# EAGLE schematic power_supply_module (EAGLE 8.1.0)
AUTHOR: N. Jackson; REV: A; TITLE: Power Supply Module

## Sheet 1 of 8: Header and Mouting holes for Power Module
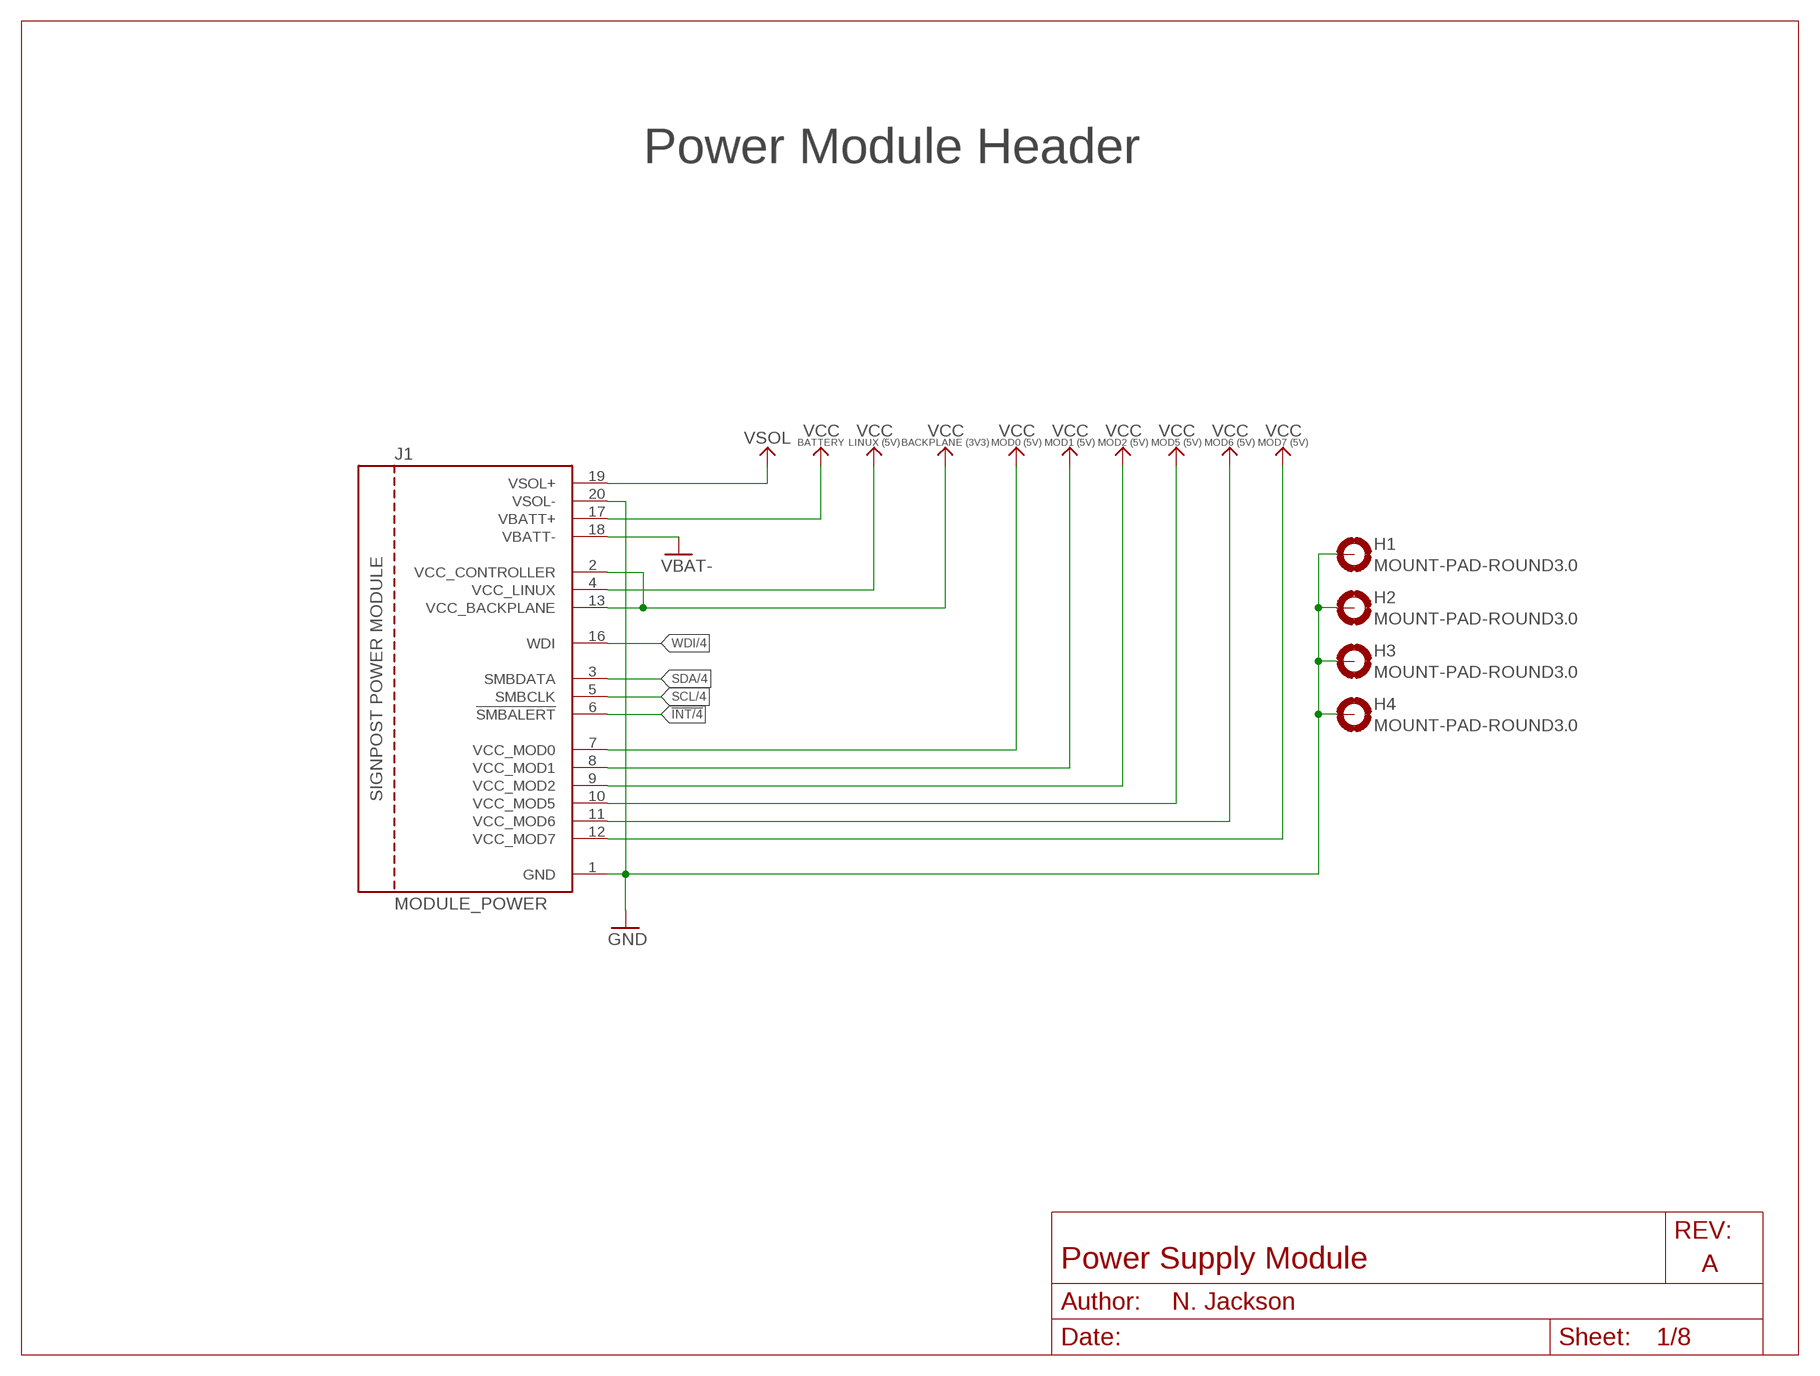
[diagram p0: schematic, sheet 1]

### Parts
H1  MOUNT-PAD-ROUND3.0  [3,0-PAD]
H2  MOUNT-PAD-ROUND3.0  [3,0-PAD]
H3  MOUNT-PAD-ROUND3.0  [3,0-PAD]
H4  MOUNT-PAD-ROUND3.0  [3,0-PAD]
J1  MODULE_POWER  [MODULE_POWER]

### Nets
!INT: J1.6(!SMBALERT) ; also sheet 4,6,7
GND: H1.B3,0(MOUNT) H2.B3,0(MOUNT) H3.B3,0(MOUNT) H4.B3,0(MOUNT) J1.1(GND) J1.20(VSOL-) ; also sheet 2,3,4,5,6,7,8
SCL: J1.5(SMBCLK) ; also sheet 4,5,6,7,8
SDA: J1.3(SMBDATA) ; also sheet 4,5,6,7,8
VBAT+: J1.17(VBATT+) ; supply symbol labelled VCC_BATT+ ; also sheet 2,3,4,8
VBAT-: J1.18(VBATT-) ; also sheet 4,8
VCC_BACKPLANE: J1.2(VCC_CONTROLLER) J1.13(VCC_BACKPLANE) ; also sheet 4,5,6,7,8
VCC_LINUX: J1.4(VCC_LINUX) ; also sheet 6
VCC_MOD0: J1.7(VCC_MOD0) ; also sheet 6
VCC_MOD1: J1.8(VCC_MOD1) ; also sheet 6
VCC_MOD2: J1.9(VCC_MOD2) ; also sheet 7
VCC_MOD5: J1.10(VCC_MOD5) ; also sheet 7
VCC_MOD6: J1.11(VCC_MOD6) ; also sheet 7
VCC_MOD7: J1.12(VCC_MOD7) ; also sheet 7
VSOL+: J1.19(VSOL+) ; supply symbol labelled VCC_SOL ; also sheet 4,8
WDI: J1.16(WDI) ; also sheet 4

### Notes on the sheet
- Power Module Header

## Sheet 2 of 8: Regulators for 3v3 and 5v power rails
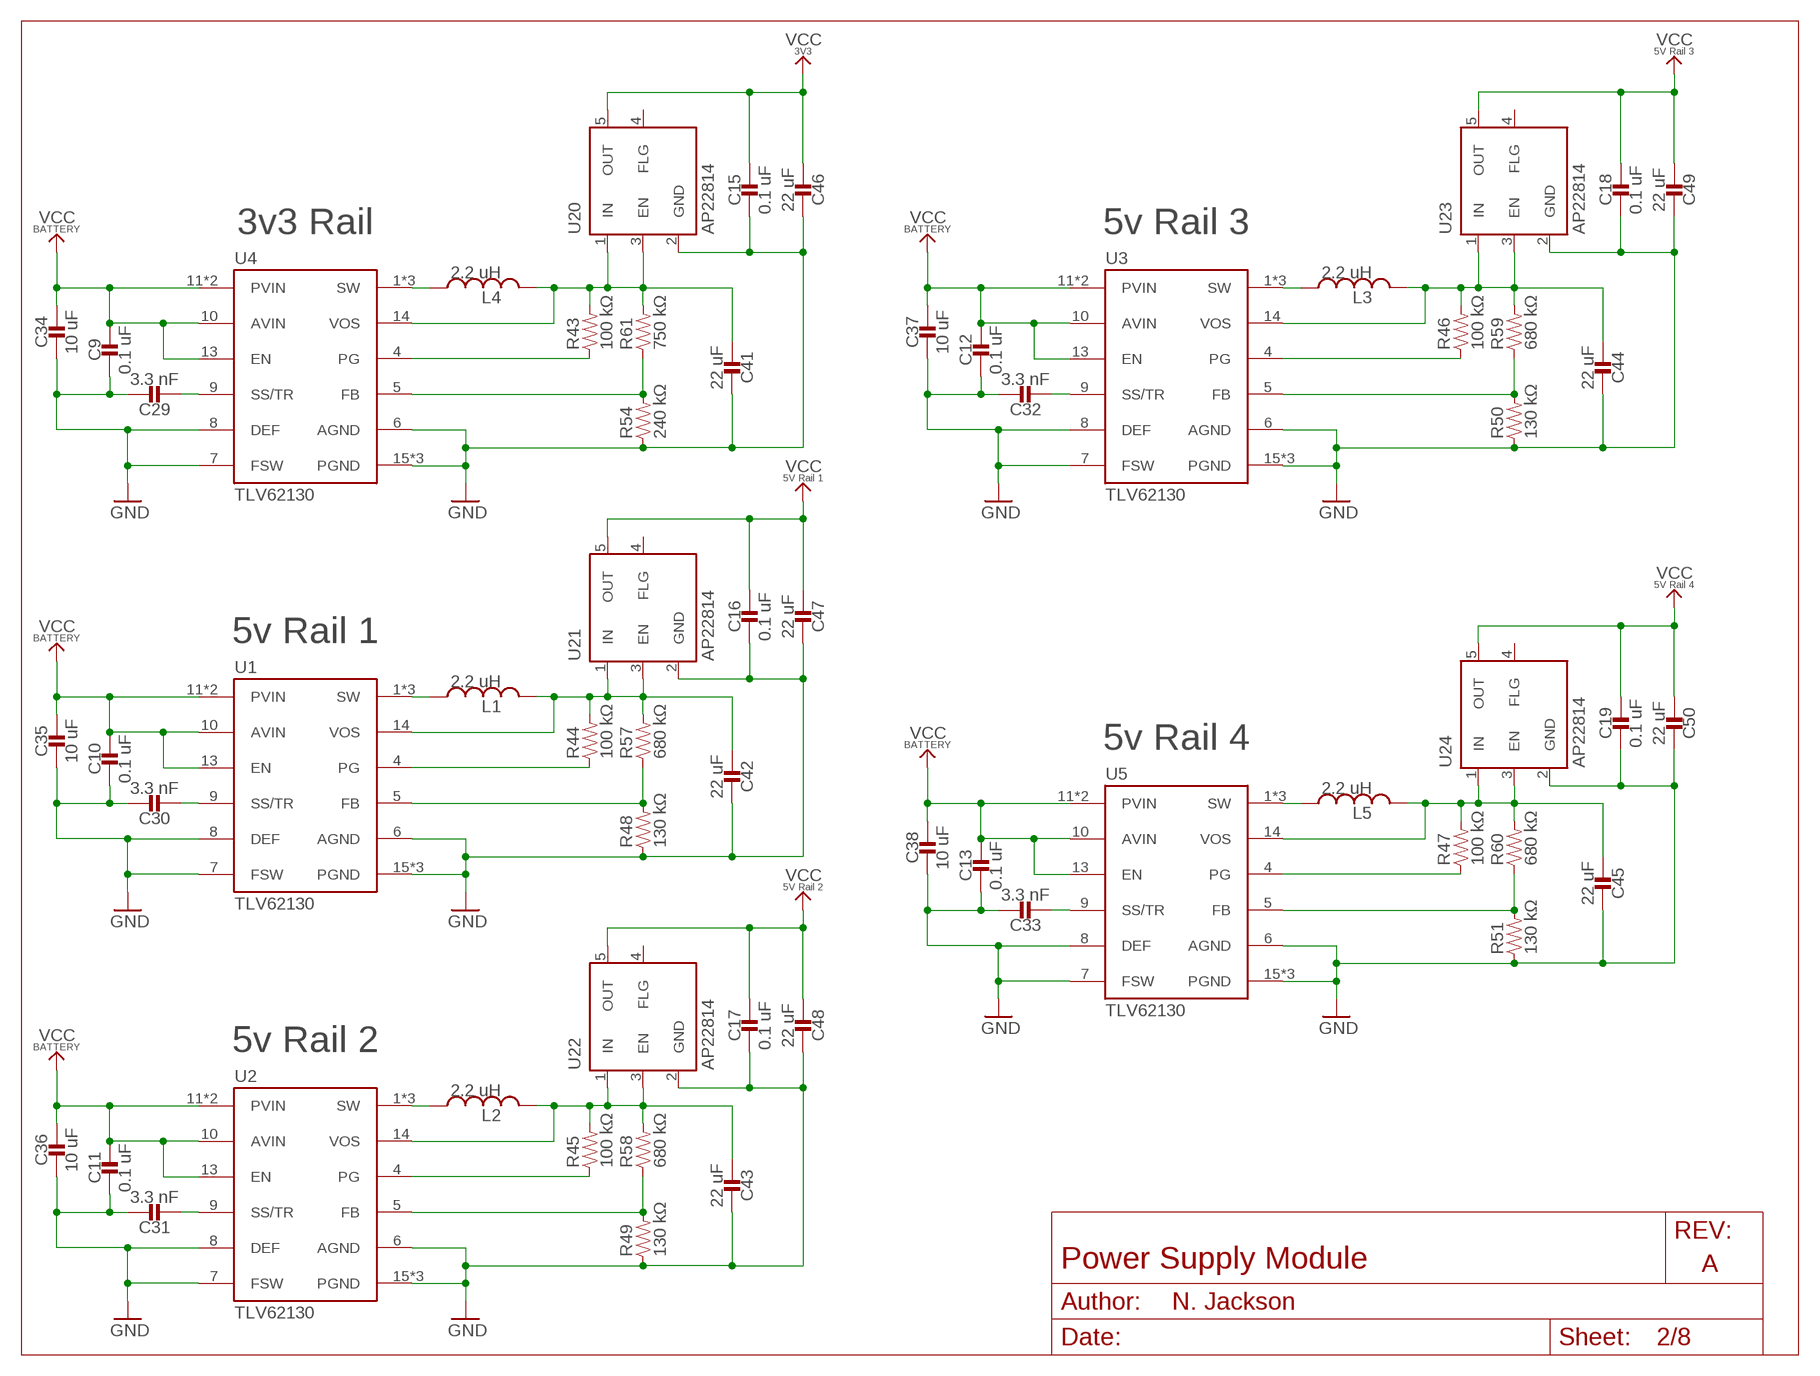
[diagram p1: schematic, sheet 2]

### Parts
C9  0.1 uF  CAPACITOR0402_CAP  [0402_CAP]
C10  0.1 uF  CAPACITOR0402_CAP  [0402_CAP]
C11  0.1 uF  CAPACITOR0402_CAP  [0402_CAP]
C12  0.1 uF  CAPACITOR0402_CAP  [0402_CAP]
C13  0.1 uF  CAPACITOR0402_CAP  [0402_CAP]
C15  0.1 uF  CAPACITOR0402_CAP  [0402_CAP]
C16  0.1 uF  CAPACITOR0402_CAP  [0402_CAP]
C17  0.1 uF  CAPACITOR0402_CAP  [0402_CAP]
C18  0.1 uF  CAPACITOR0402_CAP  [0402_CAP]
C19  0.1 uF  CAPACITOR0402_CAP  [0402_CAP]
C29  3.3 nF  CAPACITOR0402_CAP  [0402_CAP]
C30  3.3 nF  CAPACITOR0402_CAP  [0402_CAP]
C31  3.3 nF  CAPACITOR0402_CAP  [0402_CAP]
C32  3.3 nF  CAPACITOR0402_CAP  [0402_CAP]
C33  3.3 nF  CAPACITOR0402_CAP  [0402_CAP]
C34  10 uF  CAPACITOR0805_CAP  [0805_CAP]
C35  10 uF  CAPACITOR0805_CAP  [0805_CAP]
C36  10 uF  CAPACITOR0805_CAP  [0805_CAP]
C37  10 uF  CAPACITOR0805_CAP  [0805_CAP]
C38  10 uF  CAPACITOR0805_CAP  [0805_CAP]
C41  22 uF  CAPACITOR0603_CAP  [0603_CAP]
C42  22 uF  CAPACITOR0603_CAP  [0603_CAP]
C43  22 uF  CAPACITOR0603_CAP  [0603_CAP]
C44  22 uF  CAPACITOR0603_CAP  [0603_CAP]
C45  22 uF  CAPACITOR0603_CAP  [0603_CAP]
C46  22 uF  CAPACITOR0603_CAP  [0603_CAP]
C47  22 uF  CAPACITOR0603_CAP  [0603_CAP]
C48  22 uF  CAPACITOR0603_CAP  [0603_CAP]
C49  22 uF  CAPACITOR0603_CAP  [0603_CAP]
C50  22 uF  CAPACITOR0603_CAP  [0603_CAP]
L1  2.2 uH  INDUCTORIHL  [IHL-1212BZ-11]
L2  2.2 uH  INDUCTORIHL  [IHL-1212BZ-11]
L3  2.2 uH  INDUCTORIHL  [IHL-1212BZ-11]
L4  2.2 uH  INDUCTORIHL  [IHL-1212BZ-11]
L5  2.2 uH  INDUCTORIHL  [IHL-1212BZ-11]
R43  100 kΩ  RESISTOR0402_RES  [0402_RES]
R44  100 kΩ  RESISTOR0402_RES  [0402_RES]
R45  100 kΩ  RESISTOR0402_RES  [0402_RES]
R46  100 kΩ  RESISTOR0402_RES  [0402_RES]
R47  100 kΩ  RESISTOR0402_RES  [0402_RES]
R48  130 kΩ  RESISTOR0402_RES  [0402_RES]
R49  130 kΩ  RESISTOR0402_RES  [0402_RES]
R50  130 kΩ  RESISTOR0402_RES  [0402_RES]
R51  130 kΩ  RESISTOR0402_RES  [0402_RES]
R54  240 kΩ  RESISTOR0402_RES  [0402_RES]
R57  680 kΩ  RESISTOR0402_RES  [0402_RES]
R58  680 kΩ  RESISTOR0402_RES  [0402_RES]
R59  680 kΩ  RESISTOR0402_RES  [0402_RES]
R60  680 kΩ  RESISTOR0402_RES  [0402_RES]
R61  750 kΩ  RESISTOR0402_RES  [0402_RES]
U1  TLV62130  [TQFN-16/3MM]
U2  TLV62130  [TQFN-16/3MM]
U3  TLV62130  [TQFN-16/3MM]
U4  TLV62130  [TQFN-16/3MM]
U5  TLV62130  [TQFN-16/3MM]
U20  AP22814  [U-DFN2020-6]
U21  AP22814  [U-DFN2020-6]
U22  AP22814  [U-DFN2020-6]
U23  AP22814  [U-DFN2020-6]
U24  AP22814  [U-DFN2020-6]

### Nets
3V3ROUT: C41.2 L4.P$2 R43.2 R61.2 U4.14(VOS) U20.1(IN) U20.3(EN)
5V_1ROUT: C42.2 L1.P$2 R44.2 R57.2 U1.14(VOS) U21.1(IN) U21.3(EN)
5V_2ROUT: C43.2 L2.P$2 R45.2 R58.2 U2.14(VOS) U22.1(IN) U22.3(EN)
5V_3ROUT: C44.2 L3.P$2 R46.2 R59.2 U3.14(VOS) U23.1(IN) U23.3(EN)
5V_4ROUT: C45.2 L5.P$2 R47.2 R60.2 U5.14(VOS) U24.1(IN) U24.3(EN)
GND: C9.2 C10.2 C11.2 C12.2 C13.2 C15.2 C16.2 C17.2 C18.2 C19.2 C29.1 C30.1 C31.1 C32.1 C33.1 C34.P$2 C35.P$2 C36.P$2 C37.P$2 C38.P$2 C41.1 C42.1 C43.1 C44.1 C45.1 C46.1 C47.1 C48.1 C49.1 C50.1 R48.1 R49.1 R50.1 R51.1 R54.1 U1.6(AGND) U1.7(FSW) U1.8(DEF) U1.15(PGND) U1.16(PGND) U1.GND U2.6(AGND) U2.7(FSW) U2.8(DEF) U2.15(PGND) U2.16(PGND) U2.GND U3.6(AGND) U3.7(FSW) U3.8(DEF) U3.15(PGND) U3.16(PGND) U3.GND U4.6(AGND) U4.7(FSW) U4.8(DEF) U4.15(PGND) U4.16(PGND) U4.GND U5.6(AGND) U5.7(FSW) U5.8(DEF) U5.15(PGND) U5.16(PGND) U5.GND U20.2(GND) U21.2(GND) U22.2(GND) U23.2(GND) U24.2(GND) ; also sheet 1,3,4,5,6,7,8
N$1: L4.P$1 U4.1(SW) U4.2(SW) U4.3(SW)
N$3: C30.2 U1.9(SS/TR)
N$5: R44.1 U1.4(PG)
N$6: R48.2 R57.1 U1.5(FB)
N$8: C31.2 U2.9(SS/TR)
N$9: L2.P$1 U2.1(SW) U2.2(SW) U2.3(SW)
N$10: R45.1 U2.4(PG)
N$11: R49.2 R58.1 U2.5(FB)
N$15: C29.2 U4.9(SS/TR)
N$16: L1.P$1 U1.1(SW) U1.2(SW) U1.3(SW)
N$17: C32.2 U3.9(SS/TR)
N$18: R43.1 U4.4(PG)
N$19: R54.2 R61.1 U4.5(FB)
N$29: L3.P$1 U3.1(SW) U3.2(SW) U3.3(SW)
N$30: R46.1 U3.4(PG)
N$31: R50.2 R59.1 U3.5(FB)
N$34: C33.2 U5.9(SS/TR)
N$35: L5.P$1 U5.1(SW) U5.2(SW) U5.3(SW)
N$36: R47.1 U5.4(PG)
N$37: R51.2 R60.1 U5.5(FB)
VBAT+: C9.1 C10.1 C11.1 C12.1 C13.1 C34.P$1 C35.P$1 C36.P$1 C37.P$1 C38.P$1 U1.10(AVIN) U1.11(PVIN) U1.12(PVIN) U1.13(EN) U2.10(AVIN) U2.11(PVIN) U2.12(PVIN) U2.13(EN) U3.10(AVIN) U3.11(PVIN) U3.12(PVIN) U3.13(EN) U4.10(AVIN) U4.11(PVIN) U4.12(PVIN) U4.13(EN) U5.10(AVIN) U5.11(PVIN) U5.12(PVIN) U5.13(EN) ; supply symbol labelled VCC_BATT+ ; also sheet 1,3,4,8
VCC_3V3: C15.1 C46.2 U20.5(OUT) ; also sheet 6,8
VCC_5V_1: C16.1 C47.2 U21.5(OUT) ; also sheet 6,8
VCC_5V_2: C17.1 C48.2 U22.5(OUT) ; also sheet 6,8
VCC_5V_3: C18.1 C49.2 U23.5(OUT) ; also sheet 7,8
VCC_5V_4: C19.1 C50.2 U24.5(OUT) ; also sheet 7,8
Unconnected: U20.4(FLG) U21.4(FLG) U22.4(FLG) U23.4(FLG) U24.4(FLG)

### Notes on the sheet
- 3v3 Rail | 5v Rail 3
- 5v Rail 1
- 5v Rail 4
- 5v Rail 2

## Sheet 3 of 8: Solar Charger
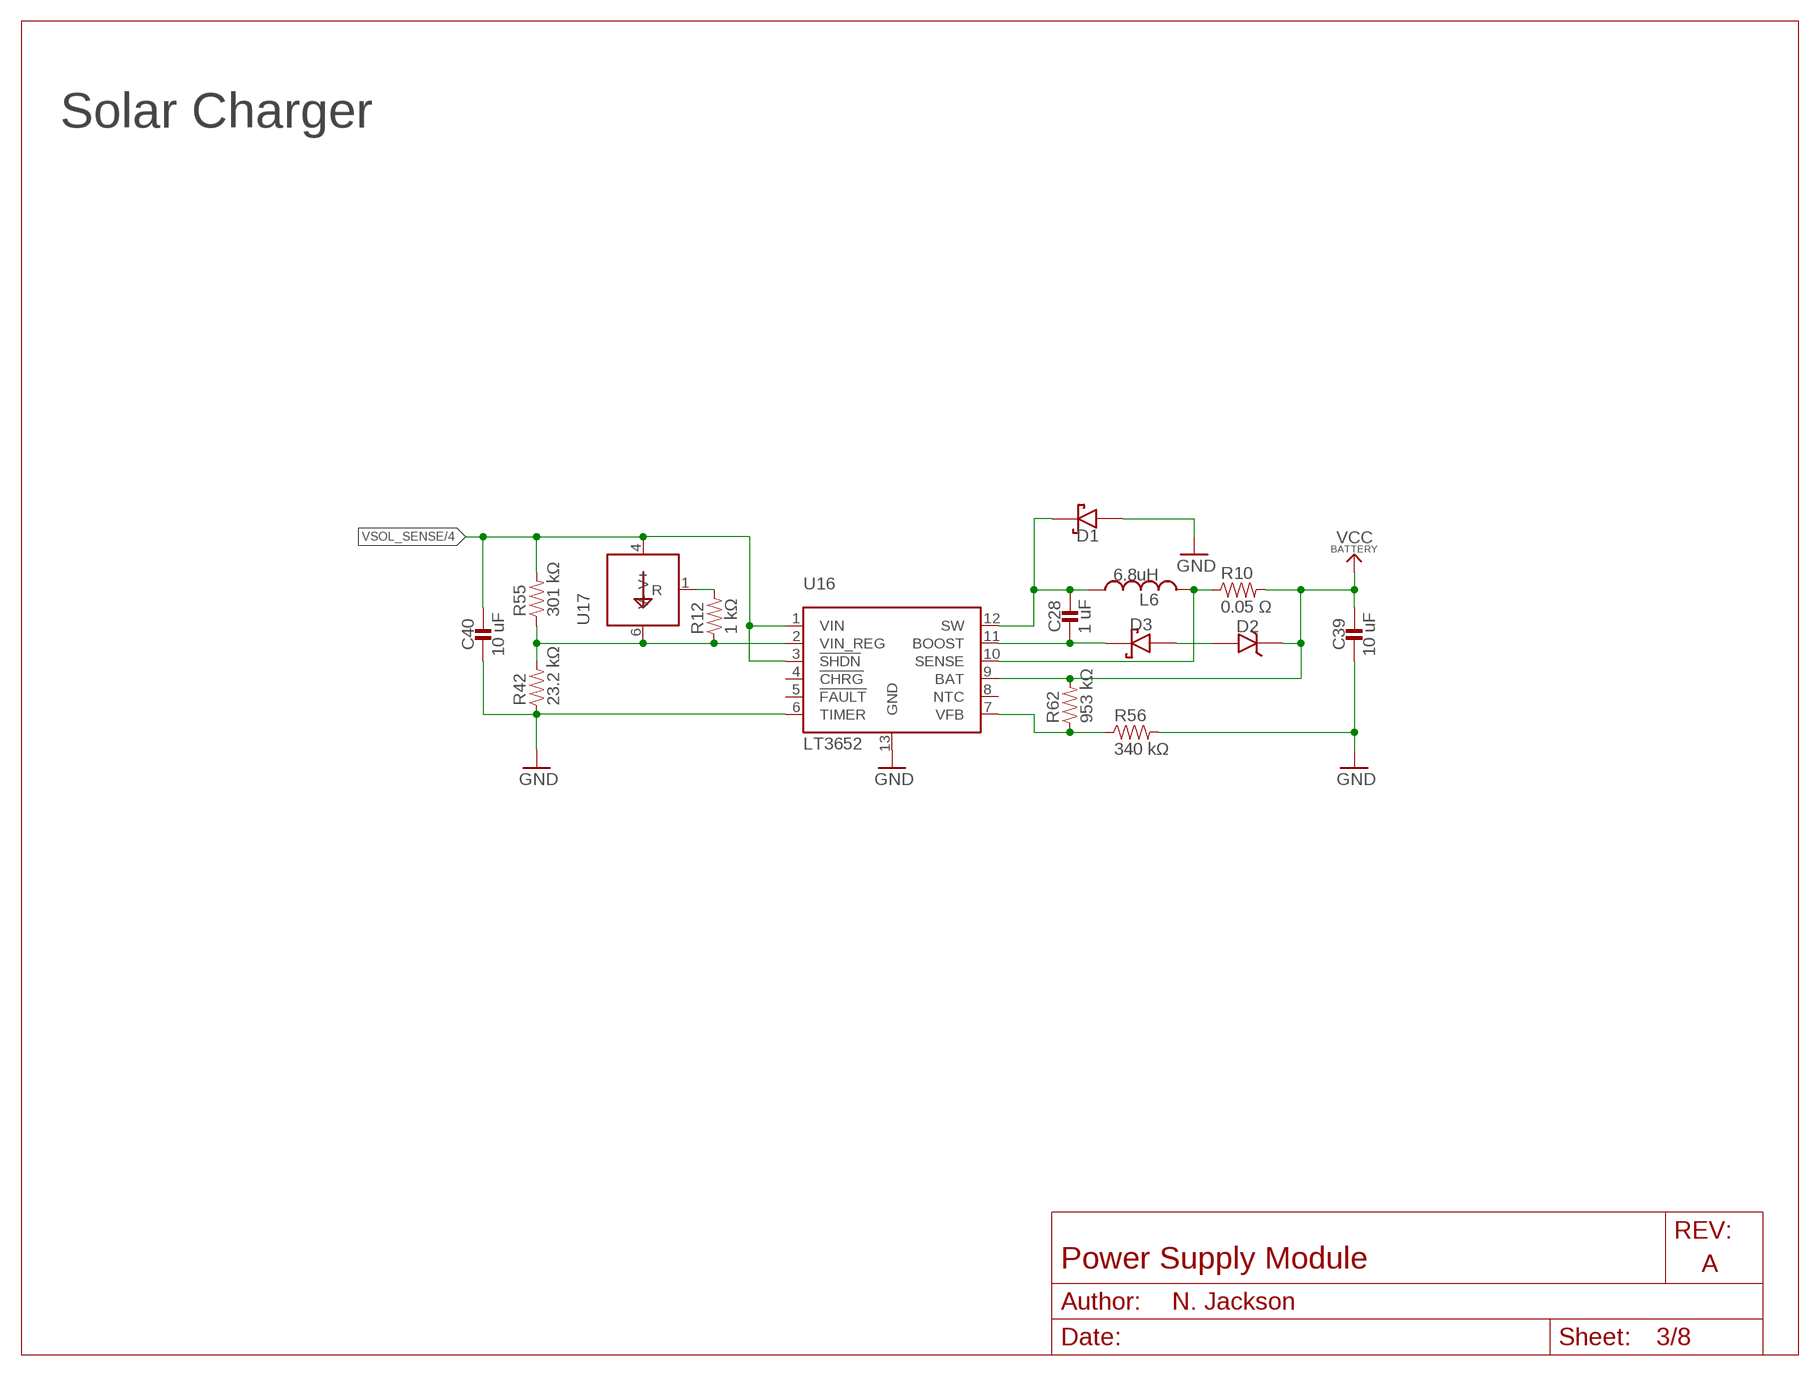
[diagram p2: schematic, sheet 3]

### Parts
C28  1 uF  CAPACITOR0603_CAP  [0603_CAP]
C39  10 uF  CAPACITOR0805_CAP  [0805_CAP]
C40  10 uF  CAPACITOR0805_CAP  [0805_CAP]
D1  DIODE_SCHOTTKYSOT-23F  [SOT-23F]
D2  DIODE_ZENERSOT323  [SOD323]
D3  DIODE_SCHOTTKYSOT-23F  [SOT-23F]
L6  6.8uH  INDUCTORIHL2525CZ  [IHL-2525CZ]
R10  0.05 Ω  RESISTOR0805_RES  [0805_RES]
R12  1 kΩ  RESISTOR0402_RES  [0402_RES]
R42  23.2 kΩ  RESISTOR0402_RES  [0402_RES]
R55  301 kΩ  RESISTOR0402_RES  [0402_RES]
R56  340 kΩ  RESISTOR0402_RES  [0402_RES]
R62  953 kΩ  RESISTOR0402_RES  [0402_RES]
U16  LT3652  [DFN-12/3MM]
U17  LM234  [SOIC-8]

### Nets
BOOST: C28.2 D3.P$3(CATHODE) U16.11(BOOST)
GND: C39.P$2 C40.P$2 D1.P$1(ANODE) R42.1 R56.2 U16.6(TIMER) U16.13(GND) ; also sheet 1,2,4,5,6,7,8
N$44: D2.P$2(ANODE) D3.P$1(ANODE)
N$59: R12.2 U17.1(R)
SENSE: L6.P$2 R10.1 U16.10(SENSE)
SW: C28.1 D1.P$3(CATHODE) L6.P$1 U16.12(SW)
VBAT+: C39.P$1 D2.P$1(CATHODE) R10.2 R62.2 U16.9(BAT) ; supply symbol labelled VCC_BATT+ ; also sheet 1,2,4,8
VFB: R56.1 R62.1 U16.7(VFB)
VINREG: R12.1 R42.2 R55.1 U16.2(VIN_REG) U17.6(V-)
VSOL_SENSE: C40.P$1 R55.2 U16.1(VIN) U16.3(!SHDN) U17.4(V+) ; also sheet 4
Unconnected: U16.4(!CHRG) U16.5(!FAULT) U16.8(NTC)

### Notes on the sheet
- Solar Charger

## Sheet 4 of 8: Battery and Solar Monitors + Watchdog
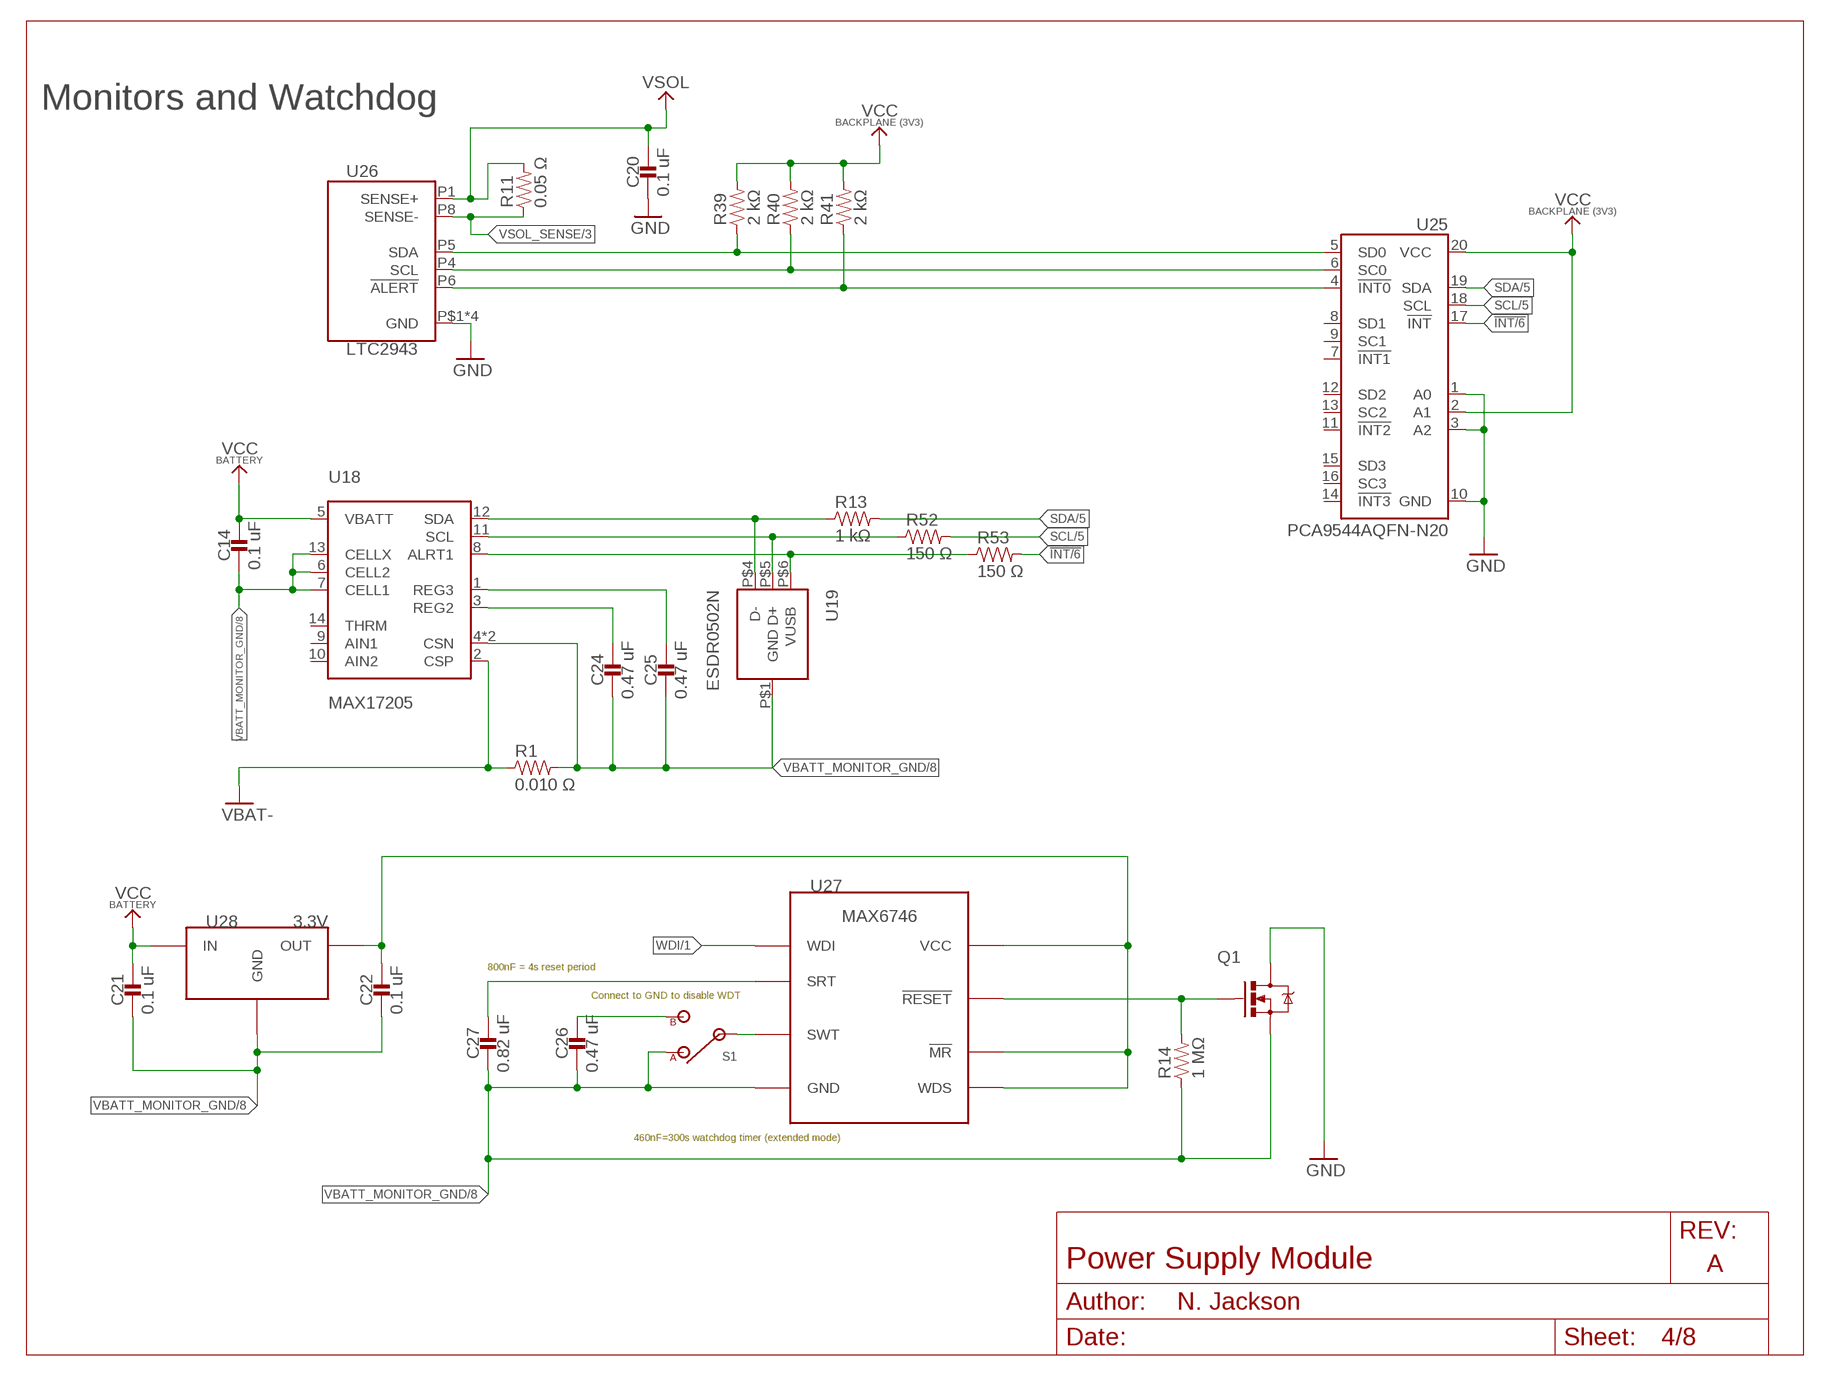
[diagram p3: schematic, sheet 4]

### Parts
C14  0.1 uF  CAPACITOR0402_CAP  [0402_CAP]
C20  0.1 uF  CAPACITOR0402_CAP  [0402_CAP]
C21  0.1 uF  CAPACITOR0402_CAP  [0402_CAP]
C22  0.1 uF  CAPACITOR0402_CAP  [0402_CAP]
C24  0.47 uF  CAPACITOR0402_CAP  [0402_CAP]
C25  0.47 uF  CAPACITOR0402_CAP  [0402_CAP]
C26  0.47 uF  CAPACITOR0402_CAP  [0402_CAP]
C27  0.82 uF  CAPACITOR0402_CAP  [0402_CAP]
Q1  MOSFET-NCHANNELFDD8580  [DPAK]
R1  0.010 Ω  RESISTOR0805_RES  [0805_RES]
R11  0.05 Ω  RESISTOR0805_RES  [0805_RES]
R13  1 kΩ  RESISTOR0402_RES  [0402_RES]
R14  1 MΩ  RESISTOR0402_RES  [0402_RES]
R39  2 kΩ  RESISTOR0402_RES  [0402_RES]
R40  2 kΩ  RESISTOR0402_RES  [0402_RES]
R41  2 kΩ  RESISTOR0402_RES  [0402_RES]
R52  150 Ω  RESISTOR0402_RES  [0402_RES]
R53  150 Ω  RESISTOR0402_RES  [0402_RES]
S1  TE_SSA12/SPDT  [TE_SSA12/SPDT]
U18  MAX17205  [14-TDFN]
U19  ESDR0502N  [UDFN-6]
U25  PCA9544AQFN-N20  [QFN-N20]
U26  LTC2943  [DFN-8]
U27  MAX6746  [SOT-23-8]
U28  3.3V  TILM34803.3V  [SOT-23]

### Nets
!INT: R53.2 U25.17(!INT) ; also sheet 1,6,7
GND: C20.2 Q1.4(D) U25.1(A0) U25.3(A2) U25.10(GND) U26.P2(GND) U26.P3(GND) U26.P7(GND) U26.P$1(GND) ; also sheet 1,2,3,5,6,7,8
N$41: C27.1 U27.3(SRT)
N$42: R13.1 U18.12(SDA) U19.P$4(D-)
N$45: C26.1 S1.2(B)
N$58: R52.1 U18.11(SCL) U19.P$5(D+)
N$60: C24.1 U18.3(REG2)
N$61: R53.1 U18.8(ALRT1) U19.P$6(VUSB)
N$62: C25.1 U18.1(REG3)
N$63: S1.IN U27.2(SWT)
N$69: Q1.1(G) R14.2 U27.7(!RESET)
N$72: C22.1 U27.1(!MR) U27.5(WDS) U27.8(VCC) U28.1(OUT)
N$73: R41.1 U25.4(!INT0) U26.P6(!ALERT)
N$74: R40.1 U25.6(SC0) U26.P4(SCL)
N$75: R39.1 U25.5(SD0) U26.P5(SDA)
SCL: R52.2 U25.18(SCL) ; also sheet 1,5,6,7,8
SDA: R13.2 U25.19(SDA) ; also sheet 1,5,6,7,8
VBAT+: C14.1 C21.1 U18.5(VBATT) U28.2(IN) ; supply symbol labelled VCC_BATT+ ; also sheet 1,2,3,8
VBAT-: R1.1 U18.2(CSP) ; also sheet 1,8
VBATT_MONITOR_GND: C14.2 C21.2 C22.2 C24.2 C25.2 C26.2 C27.2 Q1.3(S) R1.2 R14.1 S1.1(A) U18.4(CSN) U18.6(CELL2) U18.7(CELL1) U18.13(CELLX) U18.15(CSN) U19.P$1(GND) U27.4(GND) U28.3(GND) ; also sheet 8
VCC_BACKPLANE: R39.2 R40.2 R41.2 U25.2(A1) U25.20(VCC) ; also sheet 1,5,6,7,8
VSOL+: C20.1 R11.2 U26.P1(SENSE+) ; supply symbol labelled VCC_SOL ; also sheet 1,8
VSOL_SENSE: R11.1 U26.P8(SENSE-) ; also sheet 3
WDI: U27.6(WDI) ; also sheet 1
Unconnected: U18.9(AIN1) U18.10(AIN2) U18.14(THRM) U25.7(!INT1) U25.8(SD1) U25.9(SC1) U25.11(!INT2) U25.12(SD2) U25.13(SC2) U25.14(!INT3) U25.15(SD3) U25.16(SC3)

### Notes on the sheet
- Monitors and Watchdog
- 800nF = 4s reset period
- Connect to GND to disable WDT
- 460nF=300s watchdog timer (extended mode)

## Sheet 5 of 8: EEPROM ID
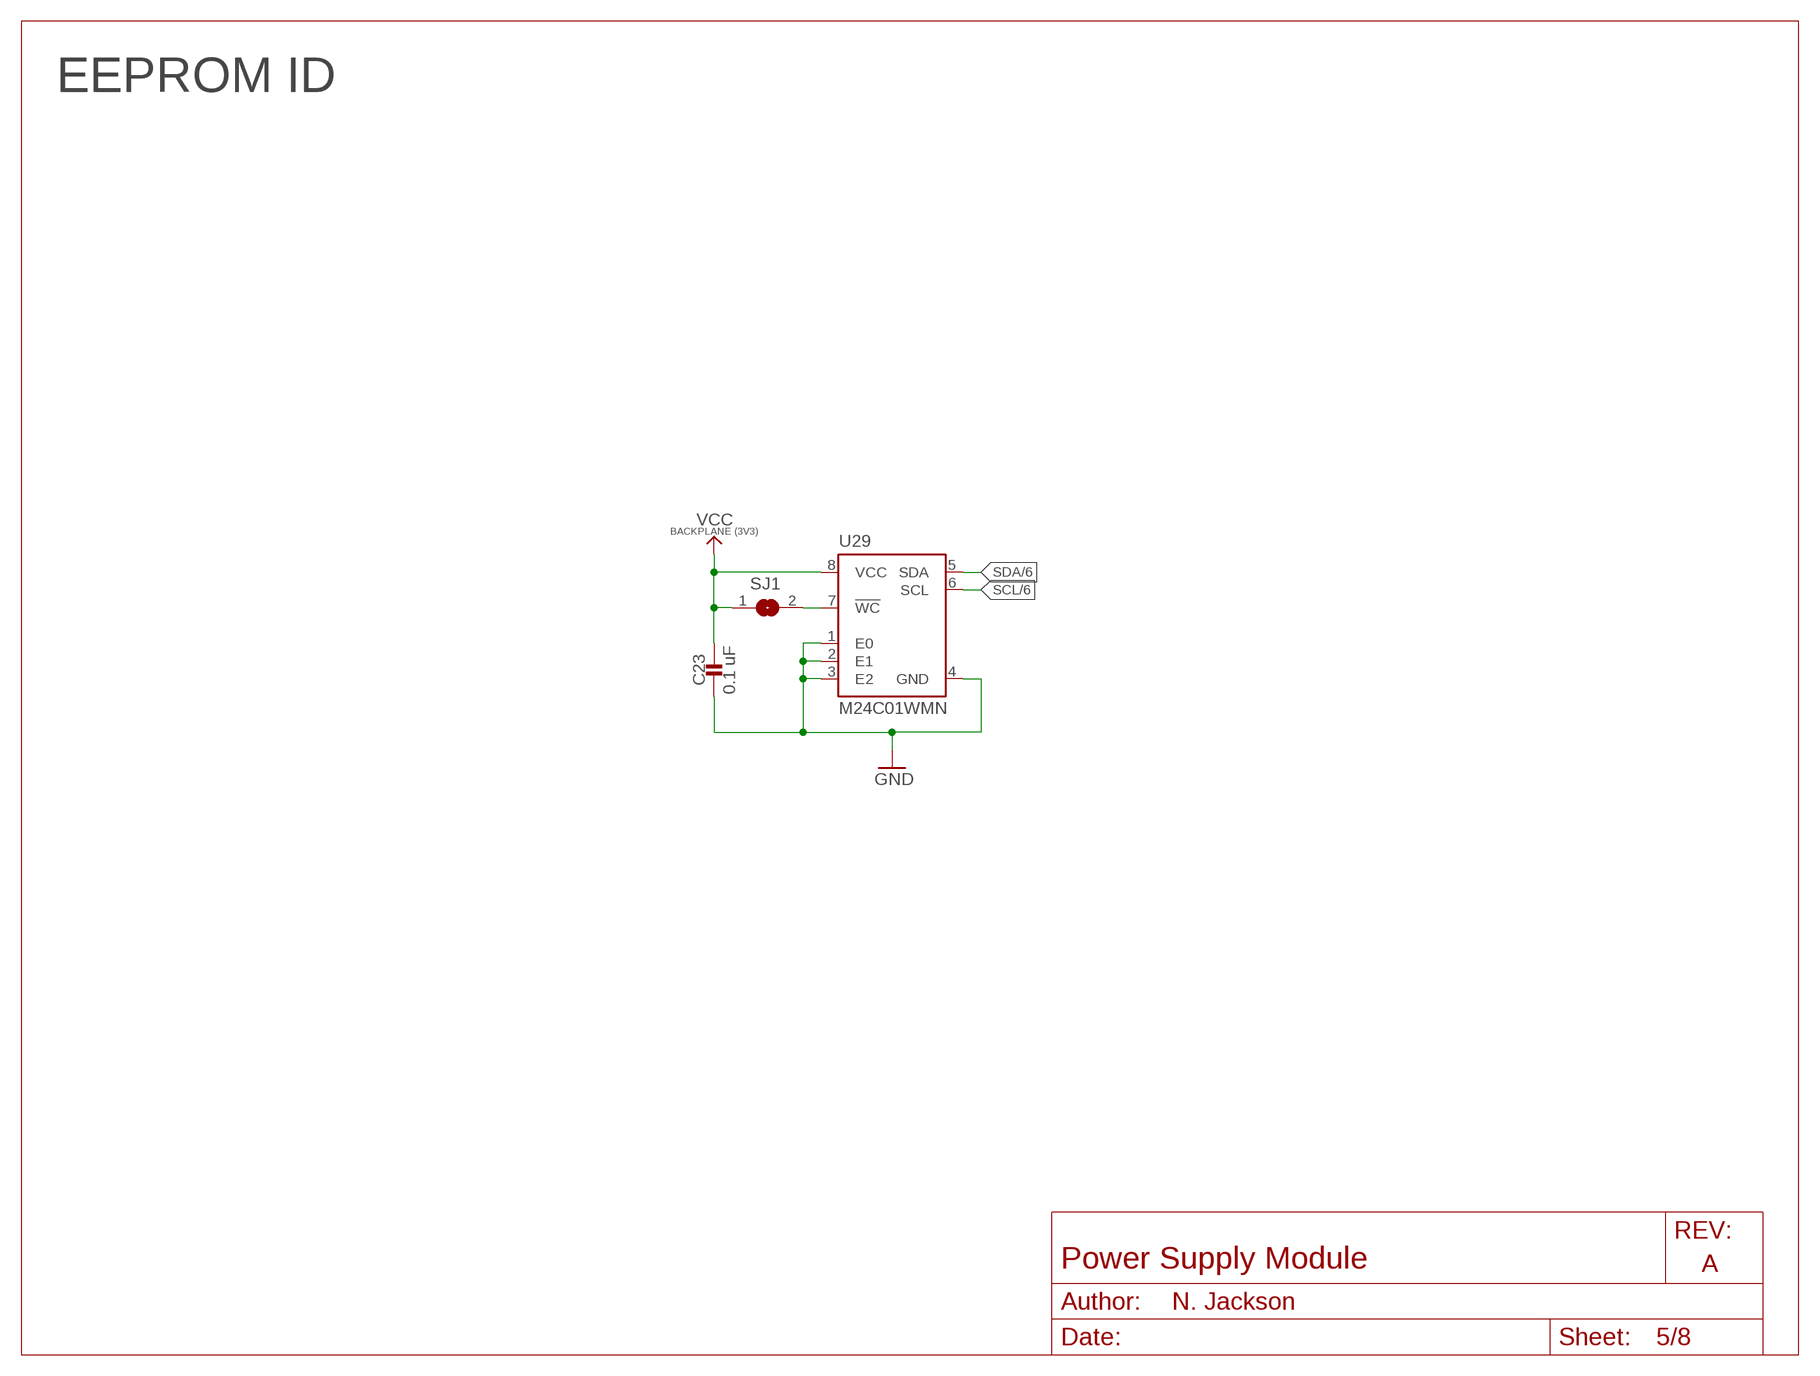
[diagram p4: schematic, sheet 5]

### Parts
C23  0.1 uF  CAPACITOR0402_CAP  [0402_CAP]
SJ1  SJ  [SJ]
U29  M24C01WMN  [SOIC-8]

### Nets
GND: C23.2 U29.1(E0) U29.2(E1) U29.3(E2) U29.4(GND) ; also sheet 1,2,3,4,6,7,8
N$64: SJ1.2 U29.7(!WC)
SCL: U29.6(SCL) ; also sheet 1,4,6,7,8
SDA: U29.5(SDA) ; also sheet 1,4,6,7,8
VCC_BACKPLANE: C23.1 SJ1.1 U29.8(VCC) ; also sheet 1,4,6,7,8

### Notes on the sheet
- EEPROM ID

## Sheet 6 of 8: Module + System Gauges
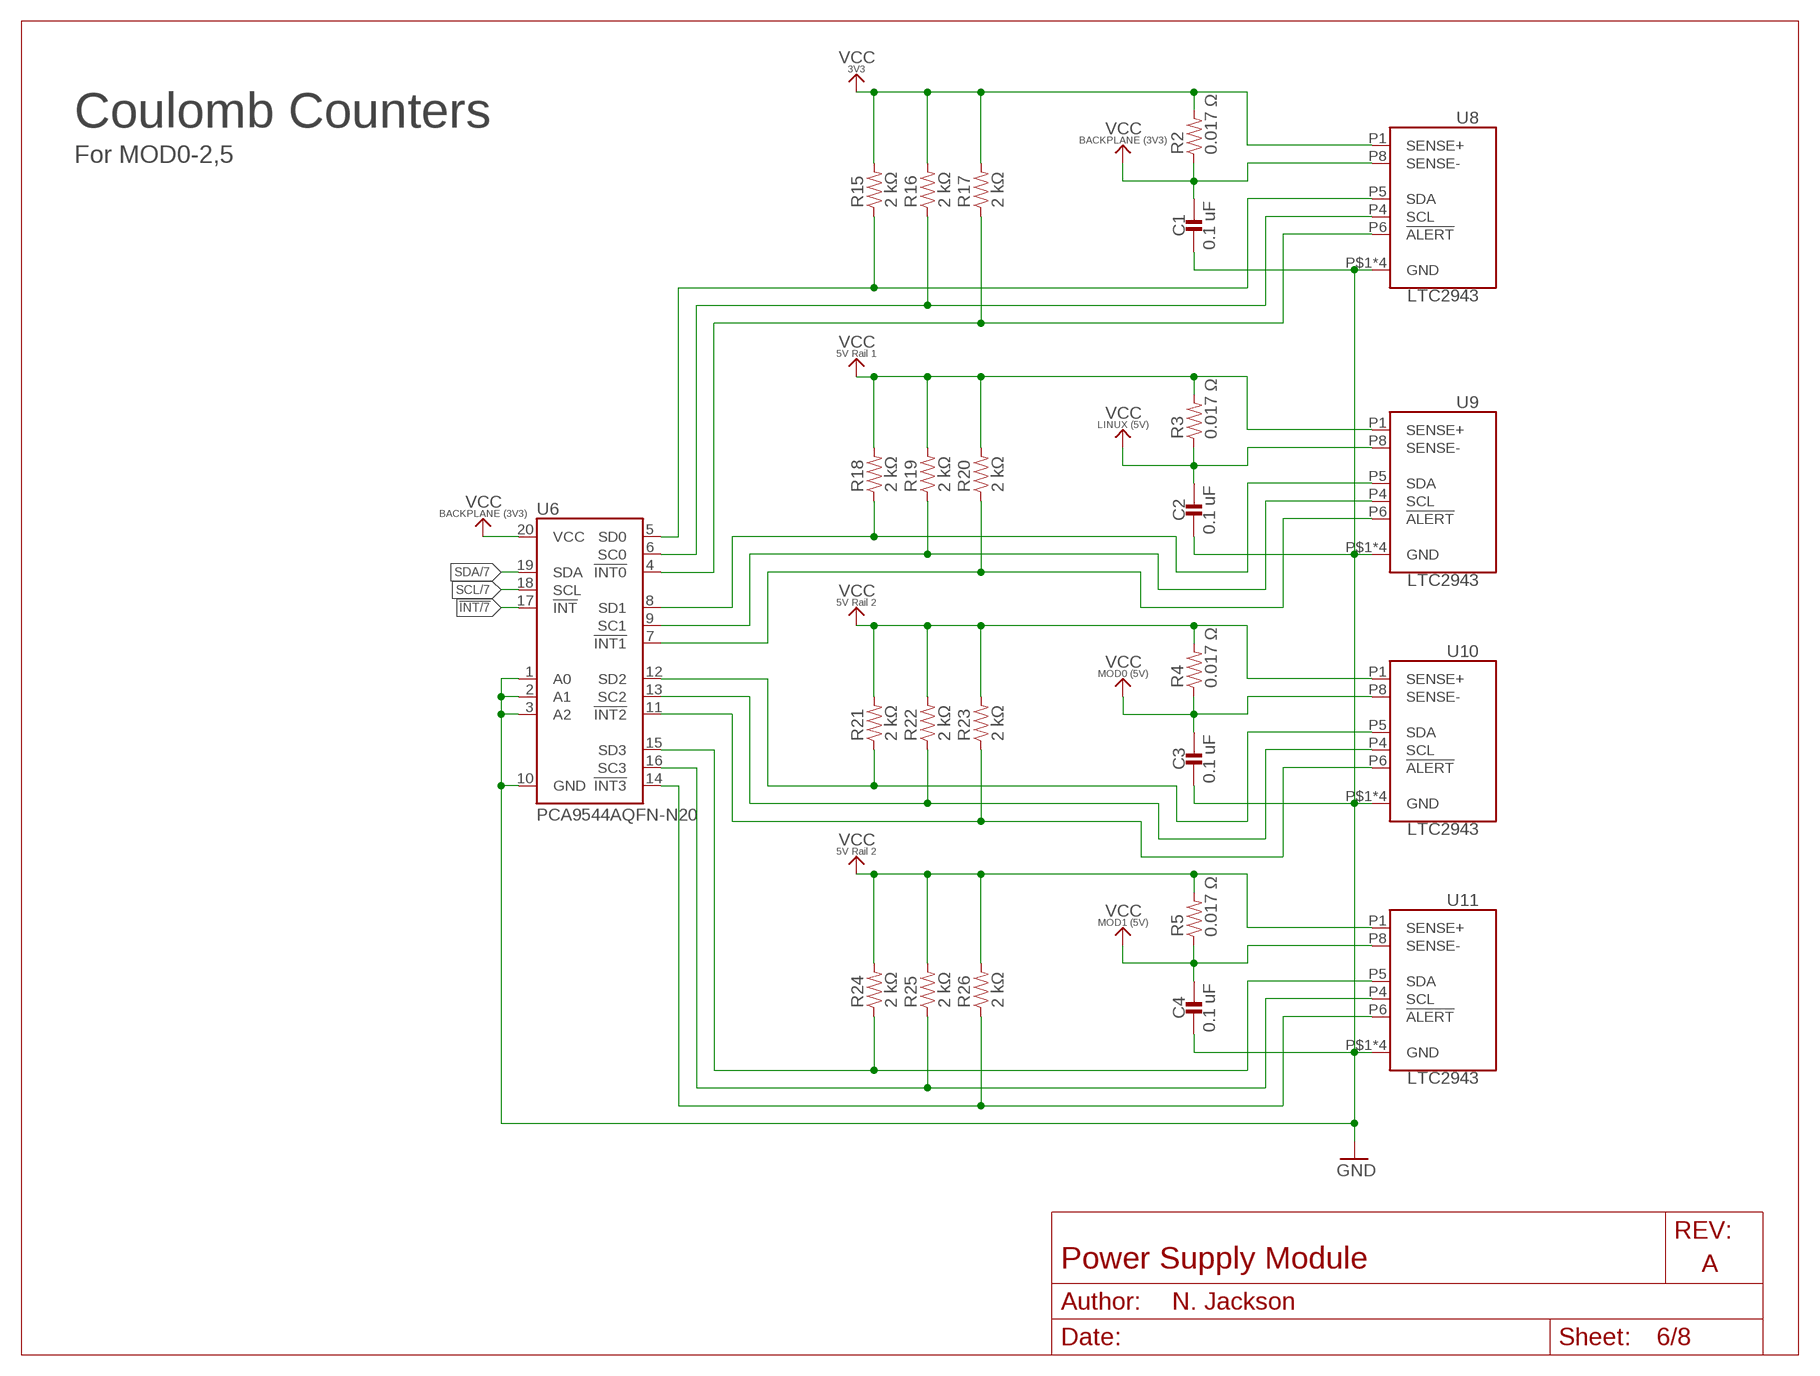
[diagram p5: schematic, sheet 6]

### Parts
C1  0.1 uF  CAPACITOR0402_CAP  [0402_CAP]
C2  0.1 uF  CAPACITOR0402_CAP  [0402_CAP]
C3  0.1 uF  CAPACITOR0402_CAP  [0402_CAP]
C4  0.1 uF  CAPACITOR0402_CAP  [0402_CAP]
R2  0.017 Ω  RESISTOR0805_RES  [0805_RES]
R3  0.017 Ω  RESISTOR0805_RES  [0805_RES]
R4  0.017 Ω  RESISTOR0805_RES  [0805_RES]
R5  0.017 Ω  RESISTOR0805_RES  [0805_RES]
R15  2 kΩ  RESISTOR0402_RES  [0402_RES]
R16  2 kΩ  RESISTOR0402_RES  [0402_RES]
R17  2 kΩ  RESISTOR0402_RES  [0402_RES]
R18  2 kΩ  RESISTOR0402_RES  [0402_RES]
R19  2 kΩ  RESISTOR0402_RES  [0402_RES]
R20  2 kΩ  RESISTOR0402_RES  [0402_RES]
R21  2 kΩ  RESISTOR0402_RES  [0402_RES]
R22  2 kΩ  RESISTOR0402_RES  [0402_RES]
R23  2 kΩ  RESISTOR0402_RES  [0402_RES]
R24  2 kΩ  RESISTOR0402_RES  [0402_RES]
R25  2 kΩ  RESISTOR0402_RES  [0402_RES]
R26  2 kΩ  RESISTOR0402_RES  [0402_RES]
U6  PCA9544AQFN-N20  [QFN-N20]
U8  LTC2943  [DFN-8]
U9  LTC2943  [DFN-8]
U10  LTC2943  [DFN-8]
U11  LTC2943  [DFN-8]

### Nets
!INT: U6.17(!INT) ; also sheet 1,4,7
GND: C1.2 C2.2 C3.2 C4.2 U6.1(A0) U6.2(A1) U6.3(A2) U6.10(GND) U8.P2(GND) U8.P3(GND) U8.P7(GND) U8.P$1(GND) U9.P2(GND) U9.P3(GND) U9.P7(GND) U9.P$1(GND) U10.P2(GND) U10.P3(GND) U10.P7(GND) U10.P$1(GND) U11.P2(GND) U11.P3(GND) U11.P7(GND) U11.P$1(GND) ; also sheet 1,2,3,4,5,7,8
N$43: R15.1 U6.5(SD0) U8.P5(SDA)
N$47: R16.1 U6.6(SC0) U8.P4(SCL)
N$52: R21.1 U6.12(SD2) U10.P5(SDA)
N$53: R22.1 U6.13(SC2) U10.P4(SCL)
N$54: R23.1 U6.11(!INT2) U10.P6(!ALERT)
N$55: R24.1 U6.15(SD3) U11.P5(SDA)
N$56: R25.1 U6.16(SC3) U11.P4(SCL)
N$57: R26.1 U6.14(!INT3) U11.P6(!ALERT)
N$67: R17.1 U6.4(!INT0) U8.P6(!ALERT)
N$68: R18.1 U6.8(SD1) U9.P5(SDA)
N$70: R19.1 U6.9(SC1) U9.P4(SCL)
N$71: R20.1 U6.7(!INT1) U9.P6(!ALERT)
SCL: U6.18(SCL) ; also sheet 1,4,5,7,8
SDA: U6.19(SDA) ; also sheet 1,4,5,7,8
VCC_3V3: R2.2 R15.2 R16.2 R17.2 U8.P1(SENSE+) ; also sheet 2,8
VCC_5V_1: R3.2 R18.2 R19.2 R20.2 U9.P1(SENSE+) ; also sheet 2,8
VCC_5V_2: R4.2 R5.2 R21.2 R22.2 R23.2 R24.2 R25.2 R26.2 U10.P1(SENSE+) U11.P1(SENSE+) ; also sheet 2,8
VCC_BACKPLANE: C1.1 R2.1 U6.20(VCC) U8.P8(SENSE-) ; also sheet 1,4,5,7,8
VCC_LINUX: C2.1 R3.1 U9.P8(SENSE-) ; also sheet 1
VCC_MOD0: C3.1 R4.1 U10.P8(SENSE-) ; also sheet 1
VCC_MOD1: C4.1 R5.1 U11.P8(SENSE-) ; also sheet 1

### Notes on the sheet
- Coulomb Counters
- For MOD0-2,5

## Sheet 7 of 8: Module Gauges
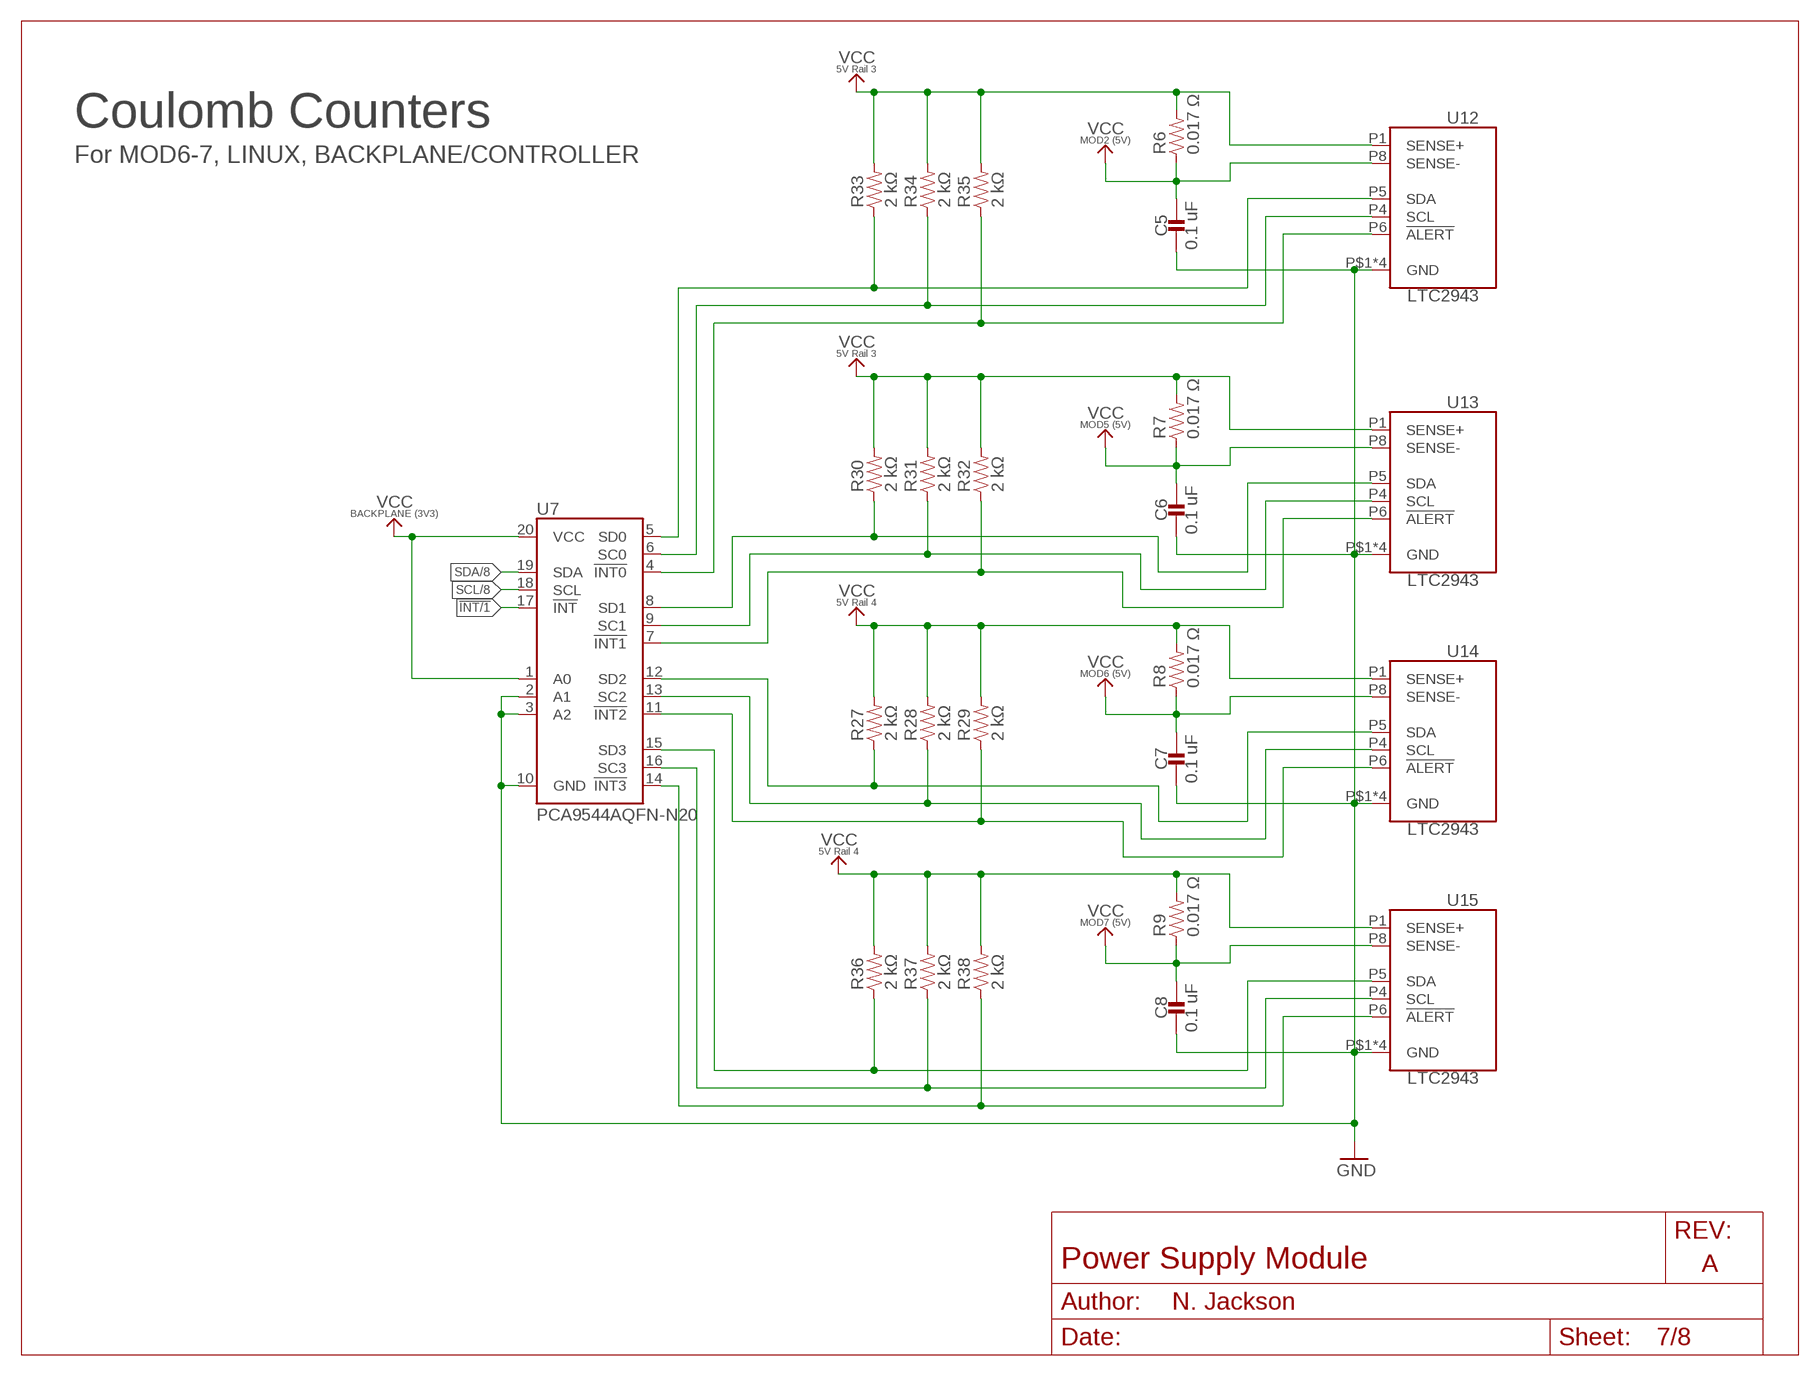
[diagram p6: schematic, sheet 7]

### Parts
C5  0.1 uF  CAPACITOR0402_CAP  [0402_CAP]
C6  0.1 uF  CAPACITOR0402_CAP  [0402_CAP]
C7  0.1 uF  CAPACITOR0402_CAP  [0402_CAP]
C8  0.1 uF  CAPACITOR0402_CAP  [0402_CAP]
R6  0.017 Ω  RESISTOR0805_RES  [0805_RES]
R7  0.017 Ω  RESISTOR0805_RES  [0805_RES]
R8  0.017 Ω  RESISTOR0805_RES  [0805_RES]
R9  0.017 Ω  RESISTOR0805_RES  [0805_RES]
R27  2 kΩ  RESISTOR0402_RES  [0402_RES]
R28  2 kΩ  RESISTOR0402_RES  [0402_RES]
R29  2 kΩ  RESISTOR0402_RES  [0402_RES]
R30  2 kΩ  RESISTOR0402_RES  [0402_RES]
R31  2 kΩ  RESISTOR0402_RES  [0402_RES]
R32  2 kΩ  RESISTOR0402_RES  [0402_RES]
R33  2 kΩ  RESISTOR0402_RES  [0402_RES]
R34  2 kΩ  RESISTOR0402_RES  [0402_RES]
R35  2 kΩ  RESISTOR0402_RES  [0402_RES]
R36  2 kΩ  RESISTOR0402_RES  [0402_RES]
R37  2 kΩ  RESISTOR0402_RES  [0402_RES]
R38  2 kΩ  RESISTOR0402_RES  [0402_RES]
U7  PCA9544AQFN-N20  [QFN-N20]
U12  LTC2943  [DFN-8]
U13  LTC2943  [DFN-8]
U14  LTC2943  [DFN-8]
U15  LTC2943  [DFN-8]

### Nets
!INT: U7.17(!INT) ; also sheet 1,4,6
GND: C5.2 C6.2 C7.2 C8.2 U7.2(A1) U7.3(A2) U7.10(GND) U12.P2(GND) U12.P3(GND) U12.P7(GND) U12.P$1(GND) U13.P2(GND) U13.P3(GND) U13.P7(GND) U13.P$1(GND) U14.P2(GND) U14.P3(GND) U14.P7(GND) U14.P$1(GND) U15.P2(GND) U15.P3(GND) U15.P7(GND) U15.P$1(GND) ; also sheet 1,2,3,4,5,6,8
N$21: R33.1 U7.5(SD0) U12.P5(SDA)
N$22: R34.1 U7.6(SC0) U12.P4(SCL)
N$23: R27.1 U7.12(SD2) U14.P5(SDA)
N$24: R28.1 U7.13(SC2) U14.P4(SCL)
N$25: R29.1 U7.11(!INT2) U14.P6(!ALERT)
N$26: R36.1 U7.15(SD3) U15.P5(SDA)
N$27: R37.1 U7.16(SC3) U15.P4(SCL)
N$46: R38.1 U7.14(!INT3) U15.P6(!ALERT)
N$48: R35.1 U7.4(!INT0) U12.P6(!ALERT)
N$49: R30.1 U7.8(SD1) U13.P5(SDA)
N$50: R31.1 U7.9(SC1) U13.P4(SCL)
N$51: R32.1 U7.7(!INT1) U13.P6(!ALERT)
SCL: U7.18(SCL) ; also sheet 1,4,5,6,8
SDA: U7.19(SDA) ; also sheet 1,4,5,6,8
VCC_5V_3: R6.2 R7.2 R30.2 R31.2 R32.2 R33.2 R34.2 R35.2 U12.P1(SENSE+) U13.P1(SENSE+) ; also sheet 2,8
VCC_5V_4: R8.2 R9.2 R27.2 R28.2 R29.2 R36.2 R37.2 R38.2 U14.P1(SENSE+) U15.P1(SENSE+) ; also sheet 2,8
VCC_BACKPLANE: U7.1(A0) U7.20(VCC) ; also sheet 1,4,5,6,8
VCC_MOD2: C5.1 R6.1 U12.P8(SENSE-) ; also sheet 1
VCC_MOD5: C6.1 R7.1 U13.P8(SENSE-) ; also sheet 1
VCC_MOD6: C7.1 R8.1 U14.P8(SENSE-) ; also sheet 1
VCC_MOD7: C8.1 R9.1 U15.P8(SENSE-) ; also sheet 1

### Notes on the sheet
- Coulomb Counters
- For MOD6-7, LINUX, BACKPLANE/CONTROLLER

## Sheet 8 of 8: Debug
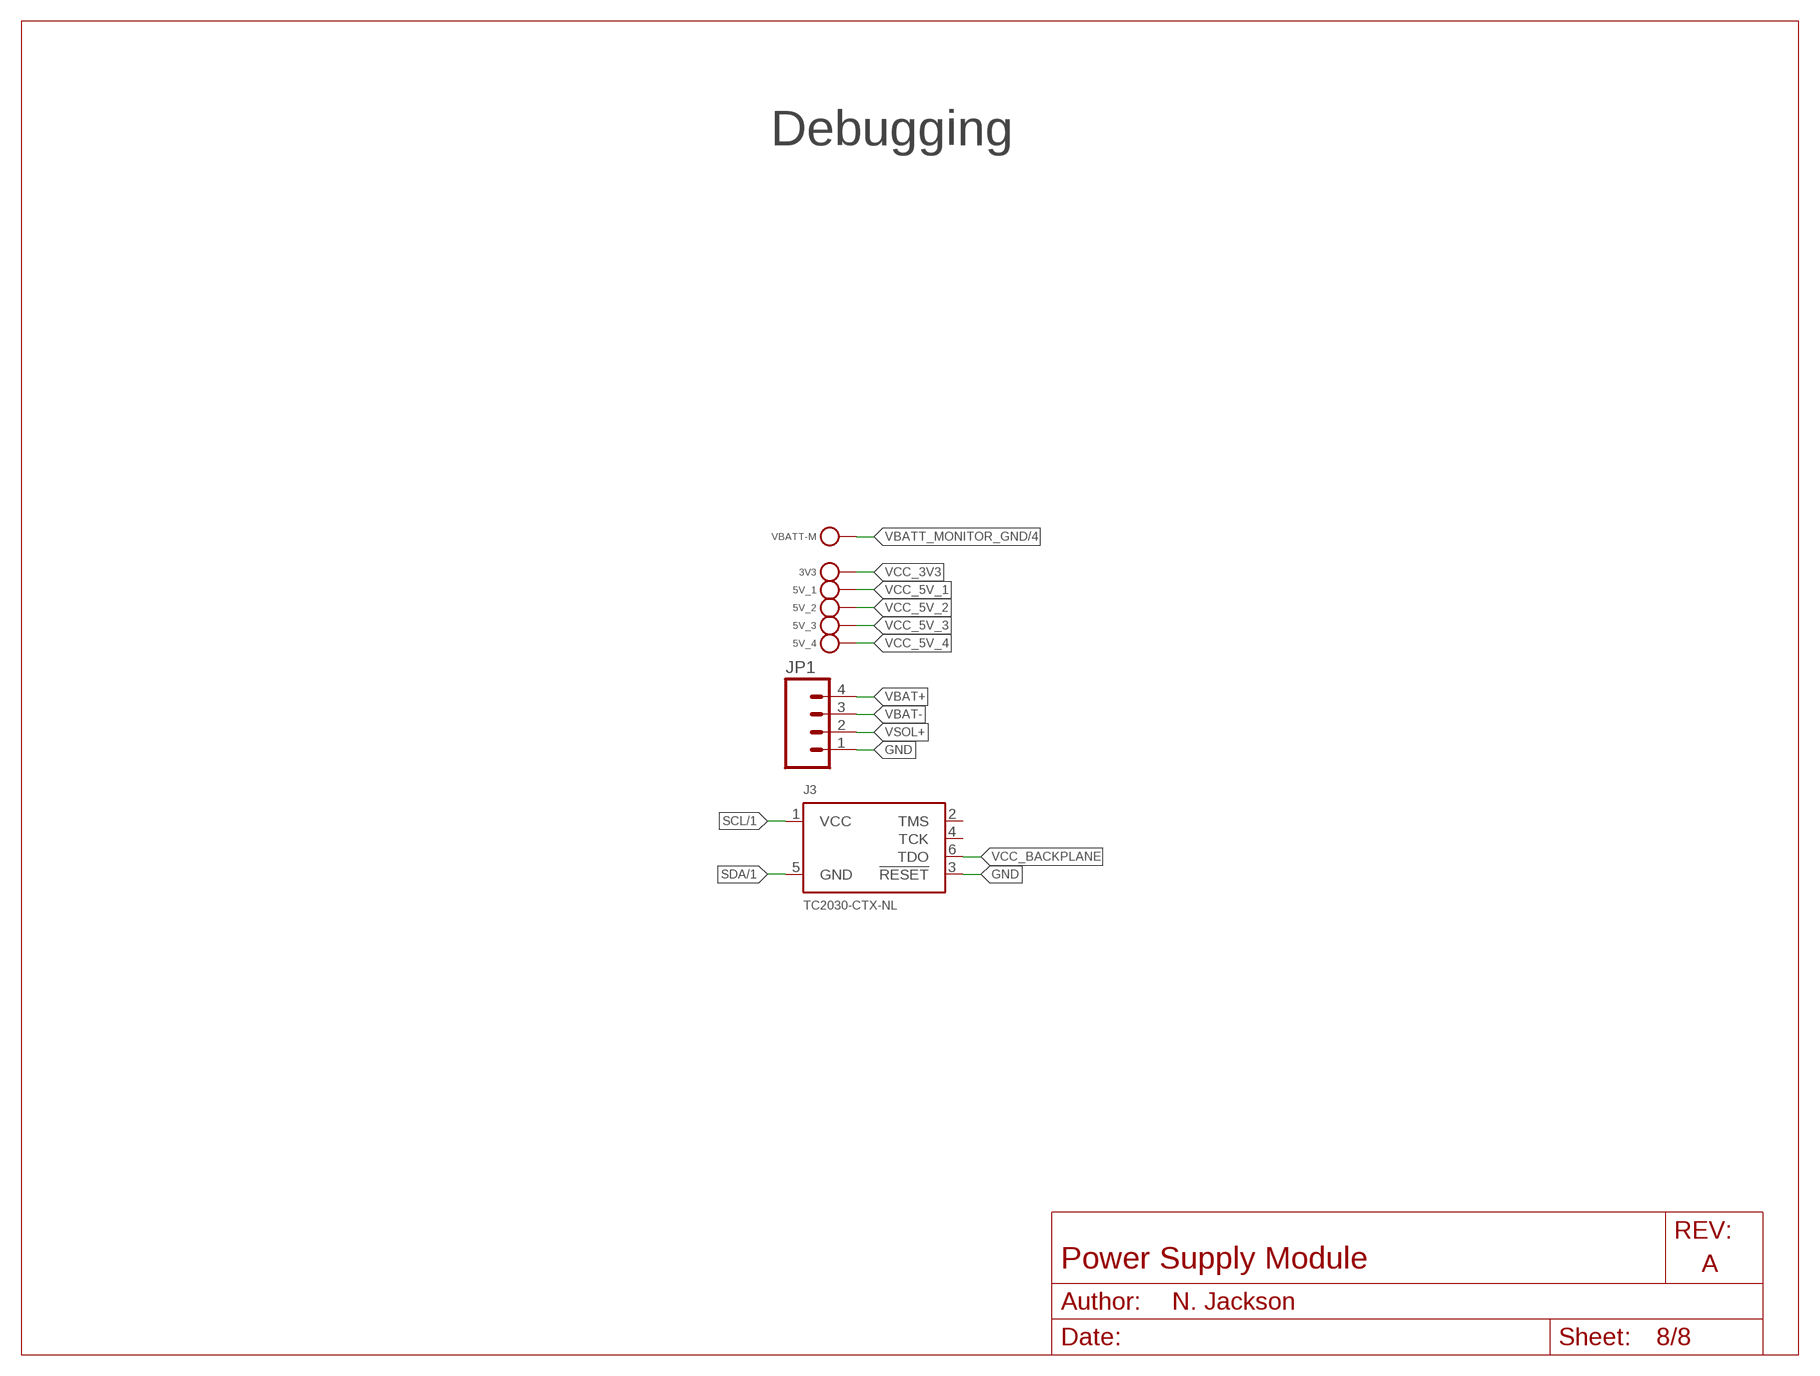
[diagram p7: schematic, sheet 8]

### Parts
3V3  TEST_POINT_0.040IN  [TESTPOINT_0.040IN]
5V_1  TEST_POINT_0.040IN  [TESTPOINT_0.040IN]
5V_2  TEST_POINT_0.040IN  [TESTPOINT_0.040IN]
5V_3  TEST_POINT_0.040IN  [TESTPOINT_0.040IN]
5V_4  TEST_POINT_0.040IN  [TESTPOINT_0.040IN]
J3  TC2030-CTX-NL  [TC2030-IDC-NL]
JP1  M04PTH  [1X04]
VBATT-M  TEST_POINT_0.040IN  [TESTPOINT_0.040IN]

### Nets
GND: J3.3(!RESET) JP1.1 ; also sheet 1,2,3,4,5,6,7
SCL: J3.1(VCC) ; also sheet 1,4,5,6,7
SDA: J3.5(GND) ; also sheet 1,4,5,6,7
VBAT+: JP1.4 ; also sheet 1,2,3,4
VBAT-: JP1.3 ; also sheet 1,4
VBATT_MONITOR_GND: VBATT-M.TESTPOINT ; also sheet 4
VCC_3V3: 3V3.TESTPOINT ; also sheet 2,6
VCC_5V_1: 5V_1.TESTPOINT ; also sheet 2,6
VCC_5V_2: 5V_2.TESTPOINT ; also sheet 2,6
VCC_5V_3: 5V_3.TESTPOINT ; also sheet 2,7
VCC_5V_4: 5V_4.TESTPOINT ; also sheet 2,7
VCC_BACKPLANE: J3.6(TDO) ; also sheet 1,4,5,6,7
VSOL+: JP1.2 ; also sheet 1,4
Unconnected: J3.2(TMS) J3.4(TCK)

### Notes on the sheet
- Debugging

## Library data of the parts
3V3 5V_1-5V_4 VBATT-M = headers:TEST_POINT_0.040IN: 0.040in Test Point; DIGIKEY: 5001K-ND
C1-C23 = passives:CAPACITOR: 0402 Capacitor; DIGIKEY: 490-5920-1-ND
C24-C26 = passives:CAPACITOR: 0402 Capacitor; DIGIKEY: 490-3266-1-ND
C27 = passives:CAPACITOR: 0402 Capacitor; DIGIKEY: 490-10440-1-ND
C28 = passives:CAPACITOR: 0402 Capacitor; DIGIKEY: 490-3890-1-ND
C29-C33 = passives:CAPACITOR: 0402 Capacitor; DIGIKEY: 490-3248-1-ND
C34-C40 = passives:CAPACITOR: 0402 Capacitor; DIGIKEY: 490-5523-1-ND
C41-C50 = passives:CAPACITOR: 0402 Capacitor; DIGIKEY: 1276-1193-1-ND
D1 = passives:DIODE_SCHOTTKY; DIGIKEY: CMPSH1-4 CT-ND
D2 = passives:DIODE_ZENER; DIGIKEY: 1727-5151-1-ND
D3 = passives:DIODE_SCHOTTKY; DIGIKEY: CMDSH2-4L CT-ND
H1-H4 = holes:MOUNT-PAD-ROUND: MOUNTING PAD, round
J1 = signpost:MODULE_POWER: Header for power module for signpost; DIGIKEY: S9172-ND
J3 = connector:TC2030-CTX: Tag Connect footprint for ARM JTAG. 10 pin ARM Cortex Debug Connector.
JP1 = SparkFun-Connectors:M04: Header 4 Standard 4-pin 0.1" header. Use with straight break away headers (SKU : PRT-00116), right angle break away headers (PRT-00553), swiss pins (PRT-00743), machine pins (PRT-00117), and female headers (PRT-00115). Molex polarized connector foot print use with SKU : PRT-08231 with associated crimp pins and housings. 1MM SMD Version SKU: PRT-10208
L1-L5 = passives:INDUCTOR: A very specific inductor; DIGIKEY: 541-1322-1-ND
L6 = passives:INDUCTOR: A very specific inductor; DIGIKEY: 541-2582-1-ND
Q1 = fets:MOSFET-NCHANNEL: Generic NMOS footprint; DIGIKEY: NTD4965NT4GOSCT-ND
R1 = passives:RESISTOR: Resistor Basic schematic elements and footprints for 0603, 1206, and PTH resistors.; DIGIKEY: WSLPB-.01CT-ND
R2-R9 = passives:RESISTOR: Resistor Basic schematic elements and footprints for 0603, 1206, and PTH resistors.; DIGIKEY: WSLPB-.017CT-ND
R10 R11 = passives:RESISTOR: Resistor Basic schematic elements and footprints for 0603, 1206, and PTH resistors.; DIGIKEY: WSLPB-.05CT-ND
R12 R13 = passives:RESISTOR: Resistor Basic schematic elements and footprints for 0603, 1206, and PTH resistors.; DIGIKEY: P1.0KJCT-ND
R14 = passives:RESISTOR: Resistor Basic schematic elements and footprints for 0603, 1206, and PTH resistors.; DIGIKEY: P1.00MLCT-ND
R15-R41 = passives:RESISTOR: Resistor Basic schematic elements and footprints for 0603, 1206, and PTH resistors.; DIGIKEY: P2.00KLCT-ND
R42 = passives:RESISTOR: Resistor Basic schematic elements and footprints for 0603, 1206, and PTH resistors.; DIGIKEY: 311-2257-1-ND
R43-R47 = passives:RESISTOR: Resistor Basic schematic elements and footprints for 0603, 1206, and PTH resistors.; DIGIKEY: P100KJCT-ND
R48-R51 = passives:RESISTOR: Resistor Basic schematic elements and footprints for 0603, 1206, and PTH resistors.; DIGIKEY: P130KLCT-ND
R52 R53 = passives:RESISTOR: Resistor Basic schematic elements and footprints for 0603, 1206, and PTH resistors.; DIGIKEY: P150LCT-ND
R54 = passives:RESISTOR: Resistor Basic schematic elements and footprints for 0603, 1206, and PTH resistors.; DIGIKEY: P240JCT-ND
R55 = passives:RESISTOR: Resistor Basic schematic elements and footprints for 0603, 1206, and PTH resistors.; DIGIKEY: P301KLCT-ND
R56 = passives:RESISTOR: Resistor Basic schematic elements and footprints for 0603, 1206, and PTH resistors.; DIGIKEY: P340KLCT-ND
R57-R60 = passives:RESISTOR: Resistor Basic schematic elements and footprints for 0603, 1206, and PTH resistors.; DIGIKEY: P680KLCT-ND
R61 = passives:RESISTOR: Resistor Basic schematic elements and footprints for 0603, 1206, and PTH resistors.; DIGIKEY: P750KJCT-ND
R62 = passives:RESISTOR: Resistor Basic schematic elements and footprints for 0603, 1206, and PTH resistors.; DIGIKEY: P953KLCT-ND
S1 = switches:TE_SSA12/SPDT: SWITCH SLIDE SPDT 2POS SSA SER; DIGIKEY: 450-1602-ND
SJ1 = jumper:SJ: SMD solder JUMPER
U1-U5 = chips:TLV62130: High Efficient 3A switching step-down regulator. 1V-5V out, 4V-17V in.; DIGIKEY: 296-35978-1-ND
U6 U7 U25 = signpost:PCA9544A: 1-4 I2C/SMBUS Multiplexer with interrupt for power supply coulomb counters; DIGIKEY: 296-20960-1-ND
U8-U15 U26 = chips:LTC2943: Multicell Battery Gas Gauge with Temperature, Voltage and Current Measurement; DIGIKEY: LTC2943IDD#PBF-ND
U16 = chips:LT3652: Solar power tracking 2A battery charger; DIGIKEY: LT3652EDD#PBF-ND
U17 = chips:LM234: 3-terminal temperature sensor; DIGIKEY: 497-1549-1-ND
U18 = chips:MAX17205: Stand-Alone ModelGauge m5 Fuel Gauge with SHA-256 Authentication; MOUSER: 700-MAX17205G+00E
U19 = chips:ESDR0502N; DIGIKEY: ESDR0502NMUTBGOSCT-ND
U20-U24 = chips:AP22814: SINGLE CHANNEL POWER DISTRIBUTION LOAD SWITCH; DIGIKEY: AP22814ASN-7DICT-ND
U27 = chips:MAX6746: A simple watchdog timer with adjustable timeouts and reset time; DIGIKEY: MAX6746KA26+TCT-ND
U28 = chips:TILM3480: Very simple LDO 100ma 3v3; DIGIKEY: LM3480IM3-3.3/NOPBCT-ND
U29 = chips:M24C01: 1K I2C™ Serial EEPROM; DIGIKEY: 497-8631-1-ND